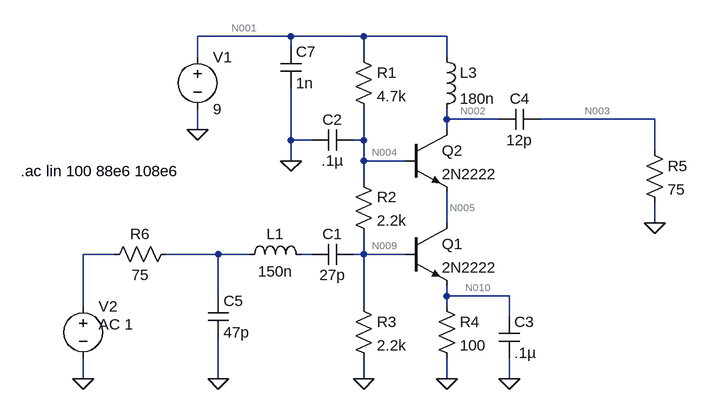
[diagram p0: schematic 2222_amp.asc]
2222_amp.asc, the LTspice schematic file:
Version 4
SHEET 1 880 680
WIRE -16 -240 -160 -240
WIRE 96 -240 -16 -240
WIRE 224 -240 96 -240
WIRE -16 -224 -16 -240
WIRE -160 -208 -160 -240
WIRE 96 -208 96 -240
WIRE 224 -208 224 -240
WIRE 224 -112 224 -128
WIRE 304 -112 224 -112
WIRE 544 -112 368 -112
WIRE -160 -96 -160 -128
WIRE 224 -96 224 -112
WIRE -16 -80 -16 -160
WIRE 16 -80 -16 -80
WIRE 96 -80 96 -128
WIRE 96 -80 80 -80
WIRE 544 -64 544 -112
WIRE -16 -48 -16 -80
WIRE 96 -48 96 -80
WIRE 160 -48 96 -48
WIRE 96 -16 96 -48
WIRE 224 48 224 0
WIRE 544 48 544 16
WIRE -288 96 -336 96
WIRE -128 96 -208 96
WIRE -80 96 -128 96
WIRE 16 96 0 96
WIRE 96 96 96 64
WIRE 96 96 80 96
WIRE 160 96 96 96
WIRE -128 160 -128 96
WIRE 224 160 224 144
WIRE 320 160 224 160
WIRE -336 176 -336 96
WIRE 96 176 96 96
WIRE 224 176 224 160
WIRE 320 192 320 160
WIRE -336 288 -336 256
WIRE -128 288 -128 224
WIRE 96 288 96 256
WIRE 224 288 224 256
WIRE 320 288 320 256
FLAG 96 288 0
FLAG 224 288 0
FLAG -160 -96 0
FLAG -16 -48 0
FLAG 320 288 0
FLAG -336 288 0
FLAG 544 48 0
FLAG -128 288 0
SYMBOL npn 160 48 R0
SYMATTR InstName Q1
SYMATTR Value 2N2222
SYMBOL npn 160 -96 R0
SYMATTR InstName Q2
SYMATTR Value 2N2222
SYMBOL res 80 -224 R0
SYMATTR InstName R1
SYMATTR Value 4.7k
SYMBOL res 80 -32 R0
SYMATTR InstName R2
SYMATTR Value 2.2k
SYMBOL res 80 160 R0
SYMATTR InstName R3
SYMATTR Value 2.2k
SYMBOL ind 208 -224 R0
SYMATTR InstName L3
SYMATTR Value 180n
SYMBOL res 208 160 R0
SYMATTR InstName R4
SYMATTR Value 100
SYMBOL cap 80 80 R90
WINDOW 0 0 32 VBottom 2
WINDOW 3 32 32 VTop 2
SYMATTR InstName C1
SYMATTR Value 27p
SYMBOL voltage -160 -224 R0
WINDOW 123 0 0 Left 0
WINDOW 39 0 0 Left 0
SYMATTR InstName V1
SYMATTR Value 9
SYMBOL cap 80 -96 R90
WINDOW 0 0 32 VBottom 2
WINDOW 3 32 32 VTop 2
SYMATTR InstName C2
SYMATTR Value .1µ
SYMBOL cap 304 192 R0
SYMATTR InstName C3
SYMATTR Value .1µ
SYMBOL voltage -336 160 R0
WINDOW 3 -196 102 Left 2
WINDOW 123 24 44 Left 2
WINDOW 39 24 152 Left 2
SYMATTR Value ""
SYMATTR Value2 AC 1
SYMATTR InstName V2
SYMBOL cap 368 -128 R90
WINDOW 0 0 32 VBottom 2
WINDOW 3 32 32 VTop 2
SYMATTR InstName C4
SYMATTR Value 12p
SYMBOL res 528 -80 R0
SYMATTR InstName R5
SYMATTR Value 75
SYMBOL res -192 80 R90
WINDOW 0 0 56 VBottom 2
WINDOW 3 32 56 VTop 2
SYMATTR InstName R6
SYMATTR Value 75
SYMBOL ind -96 112 R270
WINDOW 0 32 56 VTop 2
WINDOW 3 5 56 VBottom 2
SYMATTR InstName L1
SYMATTR Value 150n
SYMBOL cap -144 160 R0
SYMATTR InstName C5
SYMATTR Value 47p
SYMBOL cap -32 -224 R0
SYMATTR InstName C7
SYMATTR Value 1n
TEXT -432 -32 Left 2 !.ac lin 100 88e6 108e6

The netlist it stands for:
* 2222_amp.asc
Q1 N005 N009 N010 0 2N2222
Q2 N002 N004 N005 0 2N2222
R1 N001 N004 4.7k
R2 N004 N009 2.2k
R3 N009 0 2.2k
L3 N001 N002 180n
R4 N010 0 100
C1 N009 N008 27p
V1 N001 0 9
C2 N004 0 .1µ
C3 N010 0 .1µ
V2 N006 0 AC 1
C4 N003 N002 12p
R5 N003 0 75
R6 N007 N006 75
L1 N007 N008 150n
C5 N007 0 47p
C7 N001 0 1n
.model NPN NPN
.model PNP PNP
.lib standard.bjt
.ac lin 100 88e6 108e6
.backanno
.end

* Results of the author's LTspice run, read from the files saved beside the schematic
* Operating Point, zero values left out:
*   V(n005) = 3.412 V
*   V(n009) = 1.996 V
*   V(n010) = 1.272 V
*   V(n002) = 9 V
*   V(n004) = 4.136 V
*   V(n001) = 9 V
*   Ic(Q1) = 12.65 mA
*   Ib(Q1) = 64.98 µA
*   Ie(Q1) = -12.72 mA
*   Ic(Q2) = 12.59 mA
*   Ib(Q2) = 62.44 µA
*   Ie(Q2) = -12.65 mA
*   I(L3) = 12.59 mA
*   I(R1) = 1.035 mA
*   I(R2) = 972.5 µA
*   I(R3) = 907.5 µA
*   I(R4) = 12.72 mA
*   I(V1) = -13.63 mA
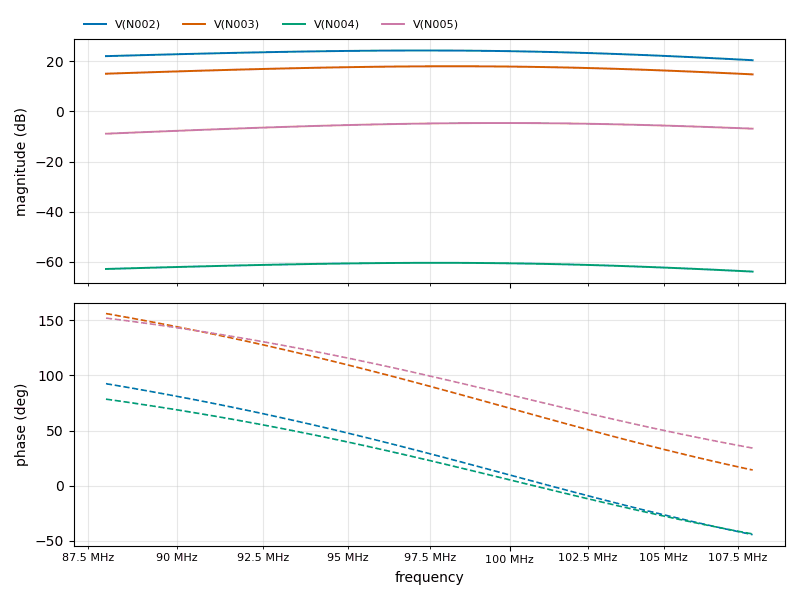
[diagram p1: AC Analysis of 2222_amp.asc, plotted from the saved traces]
* AC Analysis, 1 run:
*   V(N002): 22.13 dB at 88 MHz, 20.50 dB at 108 MHz, peak 24.39 dB at 97.29 MHz, 3 dB below the peak at 106.5 MHz
*   V(N003): 15.11 dB at 88 MHz, 14.84 dB at 108 MHz, peak 18.08 dB at 98.3 MHz, 3 dB below the peak at 107.6 MHz
*   V(N004): -62.96 dB at 88 MHz, -64.01 dB at 108 MHz, peak -60.51 dB at 97.7 MHz, 3 dB below the peak at 107.1 MHz
*   V(N005): -8.89 dB at 88 MHz, -6.87 dB at 108 MHz, peak -4.60 dB at 99.72 MHz, 3 dB below the peak at 90.2 MHz